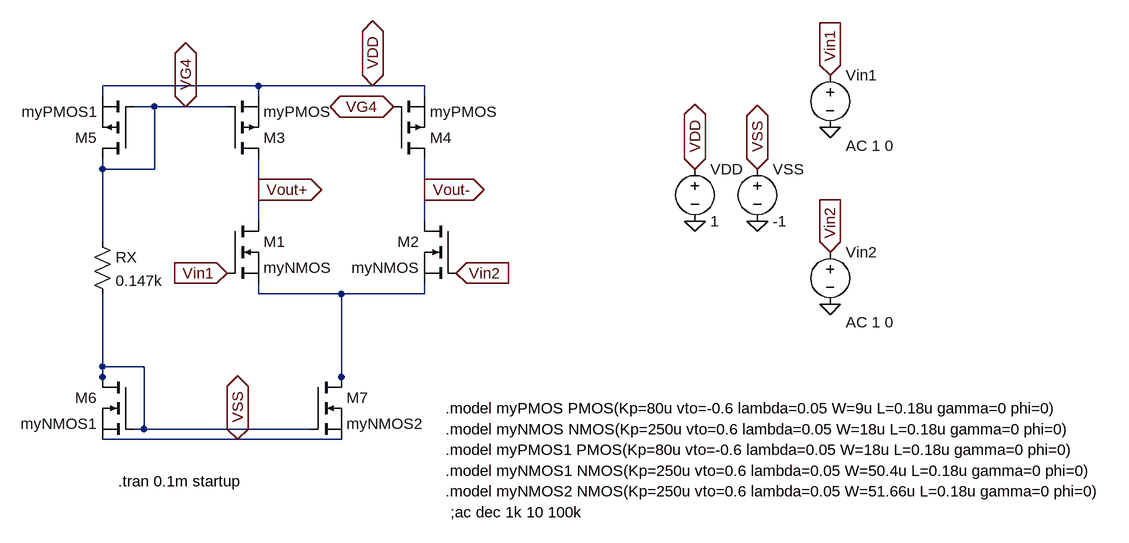
[diagram p0: schematic Project_part4.asc]
Project_part4.asc, the LTspice schematic file:
Version 4
SHEET 1 1576 756
WIRE 176 48 -64 48
WIRE 352 48 176 48
WIRE 432 48 352 48
WIRE -64 64 -64 48
WIRE 176 64 176 48
WIRE 432 64 432 48
WIRE 16 80 -16 80
WIRE 64 80 16 80
WIRE 128 80 64 80
WIRE -64 176 -64 160
WIRE 16 176 16 80
WIRE 16 176 -64 176
WIRE 176 208 176 160
WIRE 432 208 432 160
WIRE 176 256 176 208
WIRE 432 256 432 208
WIRE -64 288 -64 176
WIRE 176 368 176 352
WIRE 304 368 176 368
WIRE 432 368 432 352
WIRE 432 368 304 368
WIRE -64 480 -64 368
WIRE 0 480 -64 480
WIRE -64 496 -64 480
WIRE 304 496 304 368
WIRE -64 512 -64 496
WIRE 304 512 304 496
WIRE 0 576 0 480
WIRE 0 576 -16 576
WIRE 256 576 0 576
WIRE 144 592 -64 592
WIRE 304 592 144 592
FLAG 176 208 Vout+
IOPIN 176 208 Out
FLAG 432 208 Vout-
IOPIN 432 208 Out
FLAG 128 336 Vin1
IOPIN 128 336 In
FLAG 480 336 Vin2
IOPIN 480 336 In
FLAG 1056 384 0
FLAG 944 256 0
FLAG 848 256 0
FLAG 1056 112 0
FLAG 848 176 VDD
IOPIN 848 176 BiDir
FLAG 352 48 VDD
IOPIN 352 48 BiDir
FLAG 944 176 VSS
IOPIN 944 176 BiDir
FLAG 144 592 VSS
IOPIN 144 592 BiDir
FLAG 1056 32 Vin1
IOPIN 1056 32 In
FLAG 1056 304 Vin2
IOPIN 1056 304 In
FLAG 384 80 VG4
IOPIN 384 80 BiDir
FLAG 64 80 VG4
IOPIN 64 80 BiDir
SYMBOL pmos 384 160 M180
SYMATTR InstName M4
SYMATTR Value myPMOS
SYMBOL pmos 128 160 M180
SYMATTR InstName M3
SYMATTR Value myPMOS
SYMBOL nmos 480 256 M0
SYMATTR InstName M2
SYMATTR Value myNMOS
SYMBOL nmos 128 256 R0
SYMATTR InstName M1
SYMATTR Value myNMOS
SYMBOL pmos -16 160 R180
SYMATTR InstName M5
SYMATTR Value myPMOS1
SYMBOL res -80 272 R0
SYMATTR InstName RX
SYMATTR Value 0.147k
SYMBOL nmos -16 496 M0
SYMATTR InstName M6
SYMATTR Value myNMOS1
SYMBOL nmos 256 496 R0
SYMATTR InstName M7
SYMATTR Value myNMOS2
SYMBOL voltage 848 160 R0
WINDOW 123 0 0 Left 0
WINDOW 39 0 0 Left 0
SYMATTR InstName VDD
SYMATTR Value 1
SYMBOL voltage 944 160 R0
WINDOW 123 0 0 Left 0
WINDOW 39 0 0 Left 0
SYMATTR InstName VSS
SYMATTR Value -1
SYMBOL voltage 1056 16 R0
WINDOW 123 24 124 Left 2
WINDOW 39 0 0 Left 0
SYMATTR InstName Vin1
SYMATTR Value ""
SYMATTR Value2 AC 1 0
SYMBOL voltage 1056 288 R0
WINDOW 123 24 124 Left 2
WINDOW 39 0 0 Left 0
SYMATTR InstName Vin2
SYMATTR Value ""
SYMATTR Value2 AC 1 0
TEXT 464 544 Left 2 !.model myPMOS PMOS(Kp=80u vto=-0.6 lambda=0.05 W=9u L=0.18u gamma=0 phi=0)
TEXT 464 576 Left 2 !.model myNMOS NMOS(Kp=250u vto=0.6 lambda=0.05 W=18u L=0.18u gamma=0 phi=0)
TEXT 464 608 Left 2 !.model myPMOS1 PMOS(Kp=80u vto=-0.6 lambda=0.05 W=18u L=0.18u gamma=0 phi=0)
TEXT 472 704 Left 2 !;ac dec 1k 10 100k
TEXT 464 640 Left 2 !.model myNMOS1 NMOS(Kp=250u vto=0.6 lambda=0.05 W=50.4u L=0.18u gamma=0 phi=0)
TEXT 464 672 Left 2 !.model myNMOS2 NMOS(Kp=250u vto=0.6 lambda=0.05 W=51.66u L=0.18u gamma=0 phi=0)
TEXT -40 656 Left 2 !.tran 0.1m startup

The netlist it stands for:
* Project_part4.asc
M4 Vout- VG4 VDD VDD myPMOS
M3 Vout+ VG4 VDD VDD myPMOS
M2 Vout- Vin2 N001 N001 myNMOS
M1 Vout+ Vin1 N001 N001 myNMOS
M5 VG4 VG4 VDD VDD myPMOS1
RX VG4 N002 0.147k
M6 N002 N002 VSS VSS myNMOS1
M7 N001 N002 VSS VSS myNMOS2
VDD VDD 0 1
VSS VSS 0 -1
Vin1 Vin1 0 AC 1 0
Vin2 Vin2 0 AC 1 0
.model NMOS NMOS
.model PMOS PMOS
.lib standard.mos
.model myPMOS PMOS(Kp=80u vto=-0.6 lambda=0.05 W=9u L=0.18u gamma=0 phi=0)
.model myNMOS NMOS(Kp=250u vto=0.6 lambda=0.05 W=18u L=0.18u gamma=0 phi=0)
.model myPMOS1 PMOS(Kp=80u vto=-0.6 lambda=0.05 W=18u L=0.18u gamma=0 phi=0)
;ac dec 1k 10 100k
.model myNMOS1 NMOS(Kp=250u vto=0.6 lambda=0.05 W=50.4u L=0.18u gamma=0 phi=0)
.model myNMOS2 NMOS(Kp=250u vto=0.6 lambda=0.05 W=51.66u L=0.18u gamma=0 phi=0)
.tran 0.1m startup
.backanno
.end